# EAGLE design AlarmScrape (EAGLE 6.6.0)
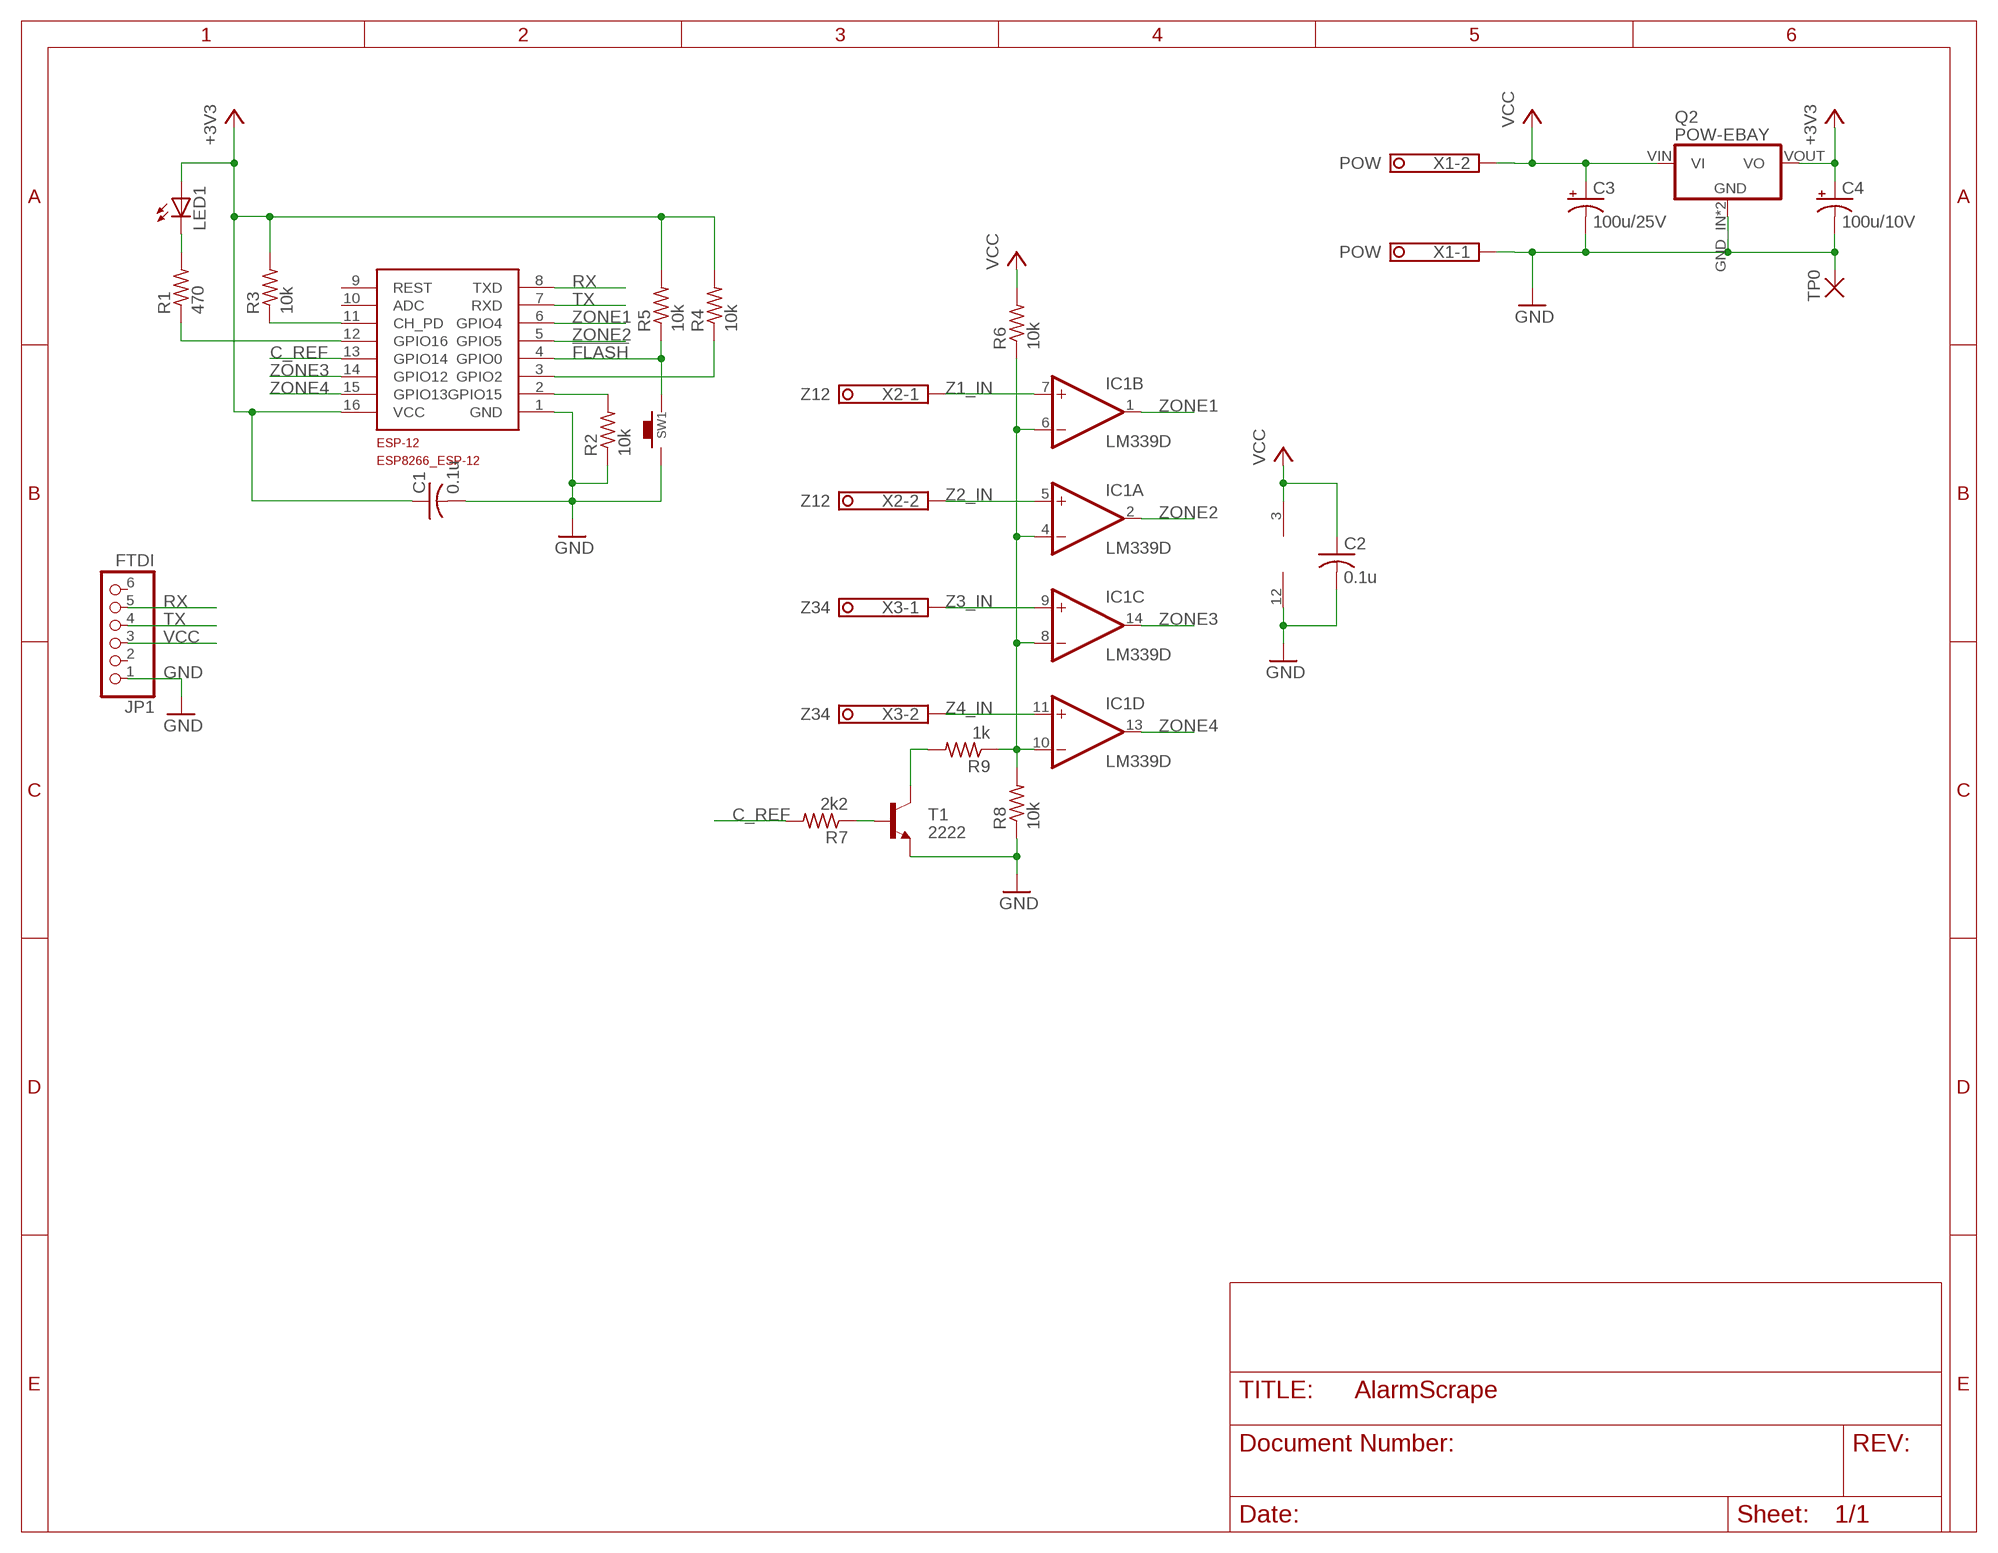
[diagram p0: schematic, sheet 1]

## Parts
C1  0.1u  C-USC0805  [C0805]
C2  0.1u  C-USC0805  [C0805]
C3  100u/25V  CPOL-USE2.5-6  [E2,5-6]
C4  100u/10V  CPOL-USE2.5-6  [E2,5-6]
ESP-12  ESP8266_ESP-12  [ESP8266-ESP12]
IC1  LM339D  [SO14]
JP1  FTDI  PINHD-1X6  [1X06]
LED1  LEDCHIPLED_0805  [CHIPLED_0805]
Q2  POW-EBAY  [POW-BUCK-EBAY]
R1  470  R-US_R0805  [R0805]
R2  10k  R-US_R0805  [R0805]
R3  10k  R-US_R0805  [R0805]
R4  10k  R-US_R0805  [R0805]
R5  10k  R-US_R0805  [R0805]
R6  10k  R-US_R0805  [R0805]
R7  2k2  R-US_R0805  [R0805]
R8  10k  R-US_R0805  [R0805]
R9  1k  R-US_R0805  [R0805]
SW1  FLASH  TACTILE-2  [TACT-4X3]
T1  2222  TRANSISTOR_NPNSOT23-3  [SOT23-3]
TP0  THROUGH-HOLE  [PAD-032]
X1  POW  1751248  [1751248]
X2  Z12  1751248  [1751248]
X3  Z34  1751248  [1751248]

## Nets
!FLASH: ESP-12.4(GPIO0) R5.1 SW1.P1
+3V3: C1.1 C4.+ ESP-12.16(VCC) LED1.A Q2.VOUT(VO) R3.2 R4.2 R5.2
C_REF: ESP-12.13(GPIO14) R7.2
GND: C1.2 C2.2 C3.- C4.- ESP-12.1(GND) IC1.12(P:GND) JP1.1 Q2.GND_IN(GND) Q2.GND_OUT(GND) R2.1 R8.1 SW1.P0 T1.2(E) TP0.P X1.1
N$1: ESP-12.12(GPIO16) R1.1
N$2: ESP-12.11(CH_PD) R3.1
N$3: ESP-12.2(GPIO15) R2.2
N$4: LED1.C R1.2
N$5: ESP-12.3(GPIO2) R4.1
N$6: R7.1 T1.1(B)
N$7: IC1.4(A:-IN) IC1.6(B:-IN) IC1.8(C:-IN) IC1.10(D:-IN) R6.1 R8.2 R9.1
N$8: R9.2 T1.3(C)
RX: ESP-12.8(TXD) JP1.5
TX: ESP-12.7(RXD) JP1.4
VCC: C2.1 C3.+ IC1.3(P:V+) JP1.3 Q2.VIN(VI) R6.2 X1.2
Z1_IN: IC1.7(B:+IN) X2.1
Z2_IN: IC1.5(A:+IN) X2.2
Z3_IN: IC1.9(C:+IN) X3.1
Z4_IN: IC1.11(D:+IN) X3.2
ZONE1: ESP-12.6(GPIO4) IC1.1(B:OUT)
ZONE2: ESP-12.5(GPIO5) IC1.2(A:OUT)
ZONE3: ESP-12.14(GPIO12) IC1.14(C:OUT)
ZONE4: ESP-12.15(GPIO13) IC1.13(D:OUT)
Unconnected: ESP-12.9(REST) ESP-12.10(ADC) JP1.2 JP1.6

## Library data of the parts
C1 C2 = resistor:C-US: CAPACITOR, American symbol
C3 C4 = resistor:CPOL-US: POLARIZED CAPACITOR, American symbol
ESP-12 = ESP8266-ESP12:ESP8266_ESP-12
IC1 = linear:LM339: Low Power Low Offset Voltage Quad Comparators with open collector; LM139/LM239/LM339/LM2901/LM3302
JP1 = pinhead:PINHD-1X6: PIN HEADER
LED1 = led:LED: LED OSRAM: - CHIPLED LG R971, LG N971, LY N971, LG Q971, LY Q971, LO R971, LY R971 LH N974, LH R974 LS Q976, LO Q976, LY Q976 LO Q996 - Hyper CHIPLED LW Q18S LB Q993, LB Q99A, LB R99A - SideLED LS A670, LO A670, LY A670, LG A670, LP A670 LB A673, LV A673, LT A673, LW A673 LH A674 LY A675 LS A676, LA A676, LO A676, LY A676, LW A676 LS A679, LY A679, LG A679 - Hyper Micro SIDELED® LS Y876, LA Y876, LO Y876, LY Y876 LT Y87S - SmartLED LW L88C, LW L88S LB L89C, LB L89S, LG L890 LS L89K, LO L89K, LY L89K LS L896, LA L896, LO L896, LY L896 - TOPLED LS T670, LO T670, LY T670, LG T670, LP T670 LSG T670, LSP T670, LSY T670, LOP T670, LYG T670 LG T671, LOG T671, LSG T671 LB T673, LV T673, LT T673, LW T673 LH T674 LS T676, LA T676, LO T676, LY T676, LB T676, LH T676, LSB T676, LW T676 LB T67C, LV T67C, LT T67C, LS T67K, LO T67K, LY T67K, LW E67C LS E67B, LA E67B, LO E67B, LY E67B, LB E67C, LV E67C, LT E67C LW T67C LS T679, LY T679, LG T679 LS T770, LO T770, LY T770, LG T770, LP T770 LB T773, LV T773, LT T773, LW T773 LH T774 LS E675, LA E675, LY E675, LS T675 LS T776, LA T776, LO T776, LY T776, LB T776 LHGB T686 LT T68C, LB T68C - Hyper Mini TOPLED® LB M676 - Mini TOPLED Santana® LG M470 LS M47K, LO M47K, LY M47K Source: http://www.osram.convergy.de LUXEON: - LUMILED® LXK2-PW12-R00, LXK2-PW12-S00, LXK2-PW14-U00, LXK2-PW14-V00 LXK2-PM12-R00, LXK2-PM12-S00, LXK2-PM14-U00 LXK2-PE12-Q00, LXK2-PE12-R00, LXK2-PE12-S00, LXK2-PE14-T00, LXK2-PE14-U00 LXK2-PB12-K00, LXK2-PB12-L00, LXK2-PB12-M00, LXK2-PB14-N00, LXK2-PB14-P00, LXK2-PB14-Q00 LXK2-PR12-L00, LXK2-PR12-M00, LXK2-PR14-Q00, LXK2-PR14-R00 LXK2-PD12-Q00, LXK2-PD12-R00, LXK2-PD12-S00 LXK2-PH12-R00, LXK2-PH12-S00 LXK2-PL12-P00, LXK2-PL12-Q00, LXK2-PL12-R00 Source: www.luxeon.com KINGBRIGHT: KA-3528ASYC Source: www.kingbright.com
Q2 = Bryan:POW-EBAY
R1-R9 = resistor:R-US_: RESISTOR, American symbol
SW1 = Bryan:TACTILE-2
T1 = SparkFun:TRANSISTOR_NPN: Transistor NPN BJT configuration in SOT23 package. MMBT2222 is the common NPN we use. Double check BCE configuration again layout.
TP0 = Bryan:THROUGH-HOLE
X1-X3 = con-phoenix-350:1751248: MKDS 1/ 2-3,5 Printklemme Nennstrom: 10 A Bemessungsspannung: 160 V Raster: 3,5 mm Polzahl: 2 Montageart: Löten Anschlussart: Schraubanschluss Anschlussrichtung vom Leiter zur Platine: 0° Source: http://eshop.phoenixcontact.com .. 1751248.pdf; OC_FARNELL: unknown; OC_NEWARK: unknown

## Board
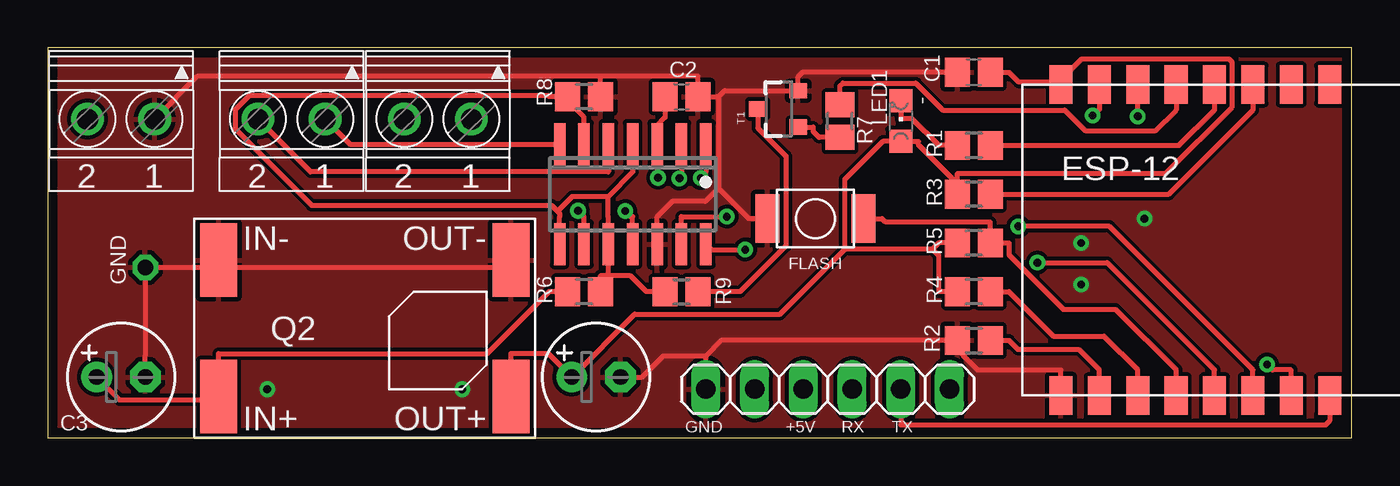
[diagram p1: board, top side]
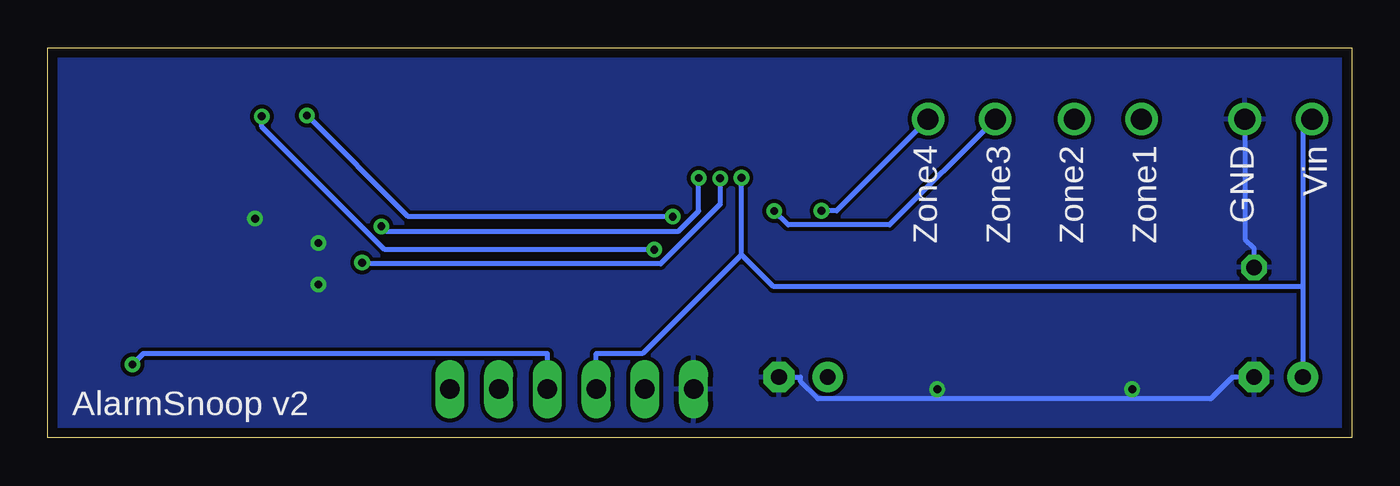
[diagram p2: board, bottom side, seen from below]

Size 67.94 x 20.32 mm. Coordinates in mm from the lower left corner, seen from the top.
Outline: 0,0 67.94,0 67.94,20.32 0,20.32 0,0
Copper layers (1*16): Top 0.035mm / dielectric 1.5mm / Bottom 0.035mm
Design rules "default *": minimum track width 10mil, minimum drill 16mil, track to track 8mil, track to pad 8mil, pad to pad 8mil, via to via 8mil, smd to smd 8mil, copper to edge 20mil, drill to drill 8mil, minimum pad ring 10mil, minimum via ring 8mil, stop-mask expansion 4mil, vias tented up to drill 16mil, thermal gap 10mil

### Footprints (pad centres in the part's own frame; a part is rotated, then mirrored left to right if it is on the bottom)
C0805 = smd 1.3 x 1.5: 1 -0.85,0; 2 0.85,0
E2,5-6 = drill 0.813 pad 1.6: + -1.27,0 | drill 0.813 pad 1.6 octagon: - 1.27,0
ESP8266-ESP12 = smd 2 x 1.2: 1 16.2,2; 2 16.2,4; 3 16.2,6; 4 16.2,8; 5 16.2,10; 6 16.2,12; 7 16.2,14; 8 16.2,16; 9 0,16; 10 0,14; 11 0,12; 12 0,10; 13 0,8; 14 0,6; 15 0,4; 16 0,2
SO14 = smd 0.6 x 2.2: 1 -3.81,-2.6; 2 -2.54,-2.6; 3 -1.27,-2.6; 4 0,-2.6; 5 1.27,-2.6; 6 2.54,-2.6; 7 3.81,-2.6; 8 3.81,2.6; 9 2.54,2.6; 10 1.27,2.6; 11 0,2.6; 12 -1.27,2.6; 13 -2.54,2.6; 14 -3.81,2.6
1X06 = drill 1.016 long: 1 -6.35,0; 2 -3.81,0; 3 -1.27,0; 4 1.27,0; 5 3.81,0; 6 6.35,0
CHIPLED_0805 = smd 1.2 x 1.2: A 0,-1.05; C 0,1.05
POW-BUCK-EBAY = smd 1.93 x 3.81: GND_IN 16.51,2.159; GND_OUT 1.27,2.159; VIN 16.51,9.271; VOUT 1.27,9.271
R0805 = smd 1.3 x 1.5: 1 -0.85,0; 2 0.85,0
TACT-4X3 = smd 1.27 x 2.54: P0 -2.5,0; P1 2.5,0
SOT23-3 = smd 0.8 x 0.9: 1 -0.95,-1; 2 0.95,-1; 3 0,1.1
PAD-032 = drill 0.813 octagon: P 0,0
1751248 = drill 1.1 pad 1.7: 1 -1.75,-0.1; 2 1.75,-0.1

### Placement (x,y rotation side)
C1  48.26,19.05 180 top
C2  33.02,17.78 0 top
C3  3.81,3.17 0 top
C4  28.57,3.17 0 top
ESP-12  50.8,18.41 270 top
IC1  30.48,12.7 180 top
JP1  40.64,2.54 0 top
LED1  44.45,16.51 0 top
Q2  25.4,11.43 180 top
R1  48.26,15.24 180 top
R2  48.26,5.08 0 top
R3  48.26,12.7 180 top
R4  48.26,7.62 180 top
R5  48.26,10.16 180 top
R6  27.94,7.62 180 top
R7  41.27,16.51 90 top
R8  27.94,17.78 180 top
R9  33.02,7.62 0 top
SW1  40.01,11.43 0 top
T1  38.1,17.14 90 top
TP0  5.08,8.89 0 top
X1  3.81,16.51 180 top
X2  12.7,16.51 180 top
X3  20.32,16.51 180 top

### Tracks (layer width: path | path; a pad name or v marks a point on that pad's centre or on a via)
!FLASH
  Top 0.254: SW1.P1 43.47,11.43 43.66,11.24 49.11,11.24 R5.1 50.09,10.16 50.09,9.54 52.92,6.71 55.64,6.71 58.8,3.54 ESP-12.4
+3V3
  Top 0.254: R4.2 46.43,7.62 46.43,9.5 46.1,9.83 | 46.1,9.83 41.54,9.83 | 46.1,9.83 46.43,10.16 R5.2 | 41.54,9.83 41.54,13.48 43.52,15.46 LED1.A 45.38,15.46 45.38,15.27 47.41,13.24 | 41.54,9.83 38.16,6.45 30.58,6.45 C4.+ 26.09,4.39 24.13,4.39 Q2.VOUT | C1.1 50.09,19.05 50.59,18.55 52.8,18.55 | 52.8,18.55 52.8,18.68 53.87,19.75 61.57,19.75 61.73,19.59 61.73,17.24 58.27,13.78 47.41,13.78 47.41,13.24 | ESP-12.16 52.8,18.55 | R3.2 47.41,13.24
C_REF
  Top 0.254: ESP-12.13 58.8,17.09 57.72,16.01 54.07,16.01 52.99,17.09 46.64,17.09 45.23,18.49 41.42,18.49 41.27,18.34 R7.2
GND  (via drill 0.41 pad 0.81)
  Top 0.254: IC1.12 31.75,11.53 32.54,12.32 34.26,12.32 34.95,13.02 | 34.95,17.78 34.95,13.02 | 34.95,13.02 36.54,11.43 SW1.P0 | 34.95,17.78 35.27,18.09 T1.2 39.1,18.82 39.33,19.05 46.43,19.05 C1.2 | 34.95,17.78 34.85,17.78 C2.2 33.87,18.86 28.79,18.86 | 34.29,4.28 35.09,5.08 46.43,5.08 46.92,5.08 | ESP-12.1 52.8,3.54 48.46,3.54 46.92,5.08 | R2.1 46.92,5.08 | 34.29,4.28 32.08,4.28 30.98,3.17 C4.- | JP1.1 34.29,4.28 | 8.89,8.89 23.98,8.89 24.13,8.74 Q2.GND_OUT | 28.79,18.86 28.79,18.75 R8.1 | X1.1 7.81,18.86 28.79,18.86 | 8.89,8.89 TP0.P 5.08,4.3 C3.- | Q2.GND_IN 8.89,8.89
  Bottom 0.254: C4.- 28.71,3.17 28.71,2.94 27.81,2.04 7.34,2.04 6.21,3.17 C3.- | TP0.P 5.08,9.88 5.56,10.36 X1.1
  other vias: 57.15,11.43 11.43,2.54 21.59,2.54 53.85,10.16 53.85,8
  pour Top: 0,0 0,20.32 67.94,20.32 67.94,0
  pour Bottom: 0,0 0,20.32 67.94,20.32 67.94,0
N$1
  Top 0.254: R1.1 50.09,15.24 58.95,15.24 60.8,17.09 ESP-12.12
N$2
  Top 0.254: ESP-12.11 62.8,17.09 58.41,12.7 R3.1
N$3
  Top 0.254: R2.2 50.09,5.08 50.55,4.62 53.72,4.62 54.8,3.54 ESP-12.2
N$4
  Top 0.254: LED1.C 44.45,16.63 45.04,16.63 46.43,15.24 R1.2
N$5
  Top 0.254: R4.1 50.09,7.62 52.4,5.31 55.04,5.31 56.8,3.54 ESP-12.3
N$6
  Top 0.254: T1.1 39.88,16.2 39.88,15.97 40.2,15.66 R7.1
N$7
  Top 0.254: 29.21,8.45 28.79,8.45 R6.1 | 29.21,8.45 30.36,8.45 31.19,7.62 R9.1 | 29.21,8.45 IC1.10 29.21,11.53 29.19,11.55 29.19,12.58 | 29.19,12.58 27.31,12.58 26.55,11.82 | 29.19,12.58 30.48,13.87 IC1.4 | 26.55,11.82 26.67,11.71 26.67,11.53 IC1.8 | 26.55,11.82 26.26,12.12 13.75,12.12 9.75,16.12 9.75,17.1 10.48,17.84 26.05,17.84 26.11,17.78 R8.2 27.09,17.58 27.94,16.73 27.94,15.9 IC1.6
N$8
  Top 0.254: T1.3 37,16.15 38.47,14.68 38.47,10.02 36.07,7.62 R9.2
RX
  Top 0.254: ESP-12.8 66.8,0.89 66.6,0.69 44.45,0.69 JP1.5
TX  (via drill 0.41 pad 0.81)
  Top 0.254: v63.55,3.83 63.83,3.54 64.8,3.54 ESP-12.7
  Bottom 0.254: v63.55,3.83 62.98,4.39 41.91,4.39 JP1.4
VCC  (via drill 0.41 pad 0.81)
  Top 0.254: R6.2 26.11,7.62 22.88,4.39 8.89,4.39 Q2.VIN 8.71,1.98 3.73,1.98 C3.+ | v31.8,13.56 31.8,13.82 31.75,13.87 IC1.3 31.75,16.28 32.17,16.7 C2.1
  Bottom 0.254: 31.8,9.56 36.96,4.39 39.37,4.39 JP1.3 | 2.54,7.89 C3.+ | X1.2 2.54,16.13 2.54,7.89 | 2.54,7.89 30.12,7.89 31.8,9.56 | 31.8,9.56 v31.8,13.56
Z1_IN
  Top 0.254: X2.1 15.76,15.3 IC1.7
Z2_IN
  Top 0.254: X2.2 13.69,13.87 29.21,13.87 IC1.5
Z3_IN  (via drill 0.41 pad 0.81)
  Top 0.254: v27.63,11.84 27.94,11.53 IC1.9
  Bottom 0.254: X3.1 26.84,11.84 v27.63,11.84 | v27.63,11.84
Z4_IN  (via drill 0.41 pad 0.81)
  Top 0.254: IC1.11 30.48,11.53 30.39,11.53 v30.1,11.82
  Bottom 0.254: X3.2 24.08,11.1 29.37,11.1 v30.1,11.82
ZONE1  (via drill 0.41 pad 0.81)
  Top 0.254: v34.02,13.54 34.02,13.61 34.29,13.87 IC1.1 | v50.56,11.03 55.32,11.03 62.8,3.54 ESP-12.6
  Bottom 0.254: v50.56,11.03 50.31,10.77 35.07,10.77 34.02,11.82 v34.02,13.54
ZONE2  (via drill 0.41 pad 0.81)
  Top 0.254: IC1.2 33.02,13.87 32.91,13.76 v32.91,13.53 | ESP-12.5 60.8,3.54 55.21,9.13 v51.57,9.13
  Bottom 0.254: v32.91,13.53 32.91,12.18 36.01,9.08 51.51,9.08 v51.57,9.13
ZONE3  (via drill 0.41 pad 0.81)
  Top 0.254: IC1.14 34.58,9.81 v36.34,9.81 | v56.8,16.76 ESP-12.14
  Bottom 0.254: v36.34,9.81 50.4,9.81 56.8,16.22 v56.8,16.76
ZONE4  (via drill 0.41 pad 0.81)
  Top 0.254: v54.45,16.8 54.73,17.09 54.8,17.09 ESP-12.15 | v35.38,11.53 33.02,11.53 IC1.13
  Bottom 0.254: v35.38,11.53 49.17,11.53 v54.45,16.8

### Text on the board
_tsilk: - | FLASH | GND | GND | +5V | RX | TX
_bsilk: Vin | GND | Zone1 | Zone2 | Zone3 | Zone4 | AlarmSnoop v2